# Altium schematic sheet 4.motor.SchDoc: 电机控制
size A4; DrawnBy: 蒋朝晖; Organization: Seneasy; DocumentNumber: 项目编号; Revision: 版本号; SheetNumber: 1; SheetTotal: 2; Time: 2018-10-20
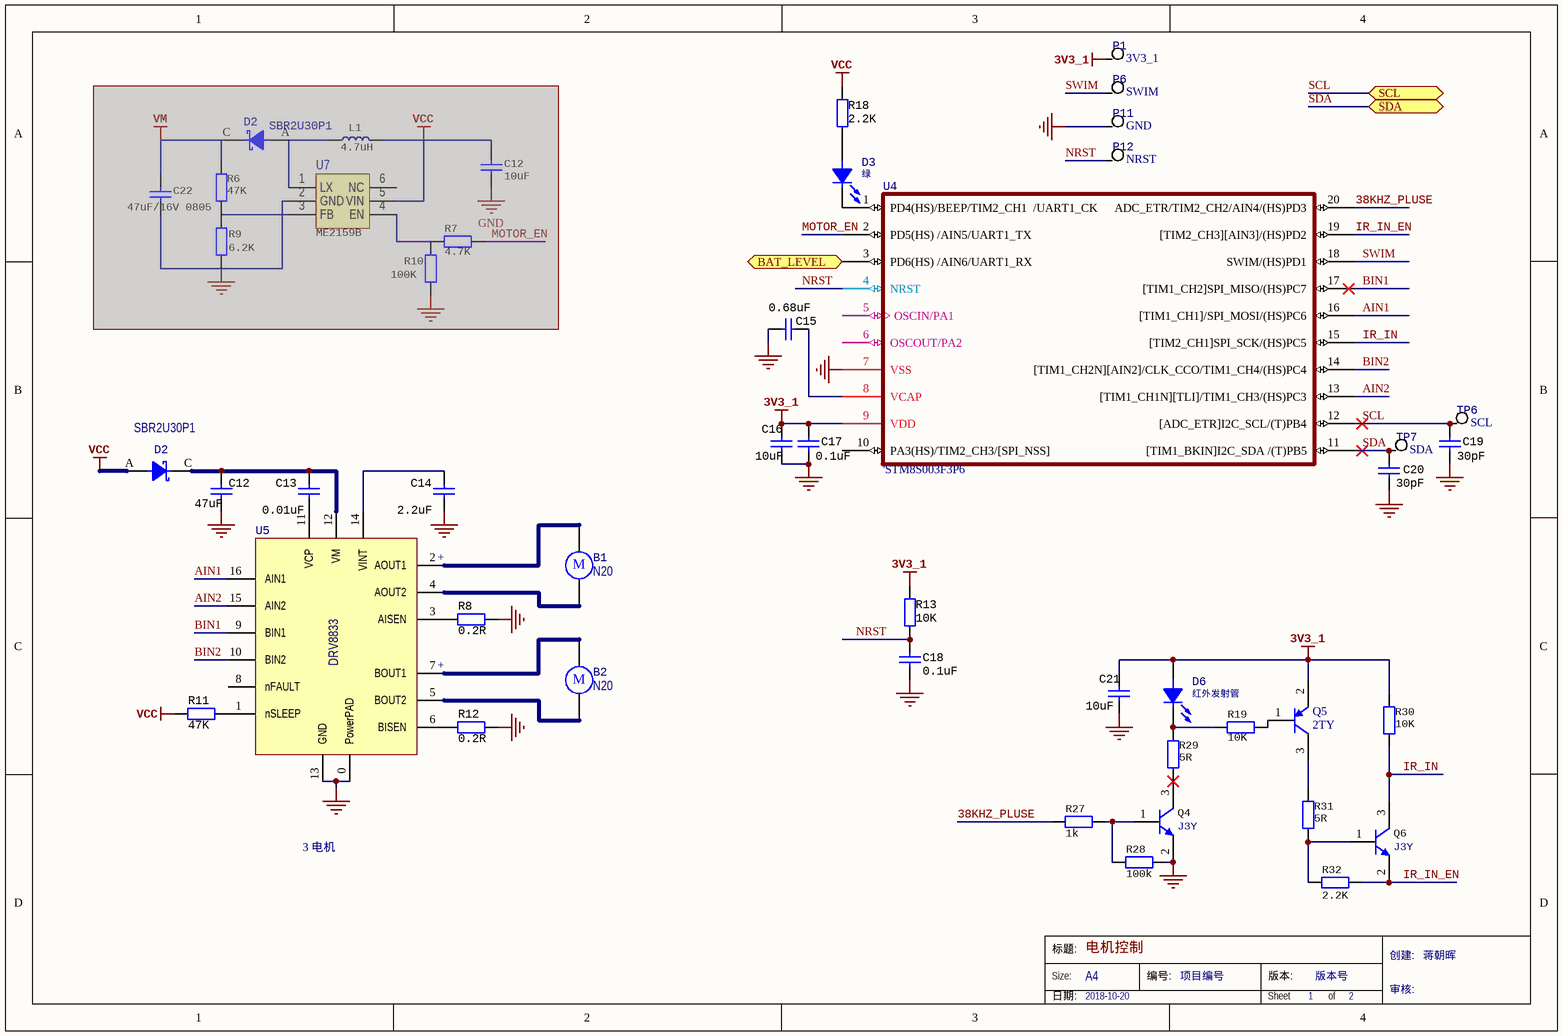
[diagram p0: 4.motor.SchDoc]

## Parts
(Parts that share a designator on the sheet are numbered #1, #2 ... from top to bottom, then left to right.)
B1  N20  [2PIN/2.54MM座子]
B2  N20  [2PIN/2.54MM座子]
C12#1  10uF  [C0603]  (masked out: inside a compile mask, not in the netlist)
C12#2  47uF  [0805]
C13  0.01uF  [0402]
C14  2.2uF  [0402]
C15  0.68uF  [0402]
C16  10uF  [0603]
C17  0.1uF  [0402]
C18  0.1uF  [0402]
C19  30pF  [0402]
C20  30pF  [0402]
C21  10uF  [C0603]
C22  47uF/16V 0805  [C0805]  (masked out: inside a compile mask, not in the netlist)
D2#1  SBR2U30P1  [POWERDI123]  (masked out: inside a compile mask, not in the netlist)
D2#2  SBR2U30P1  [POWERDI123]
D3  绿  [0603LED]
D6  红外发射管  [贴片发射管]
L1  4.7uH  [INDM8070X500N]  (masked out: inside a compile mask, not in the netlist)
P1  3V3_1  [测试点]
P6  SWIM  [测试点]
P11  GND  [测试点]
P12  NRST  [测试点]
Q4  J3Y  [DFN 3L]
Q5  2TY  [DFN 3L]
Q6  J3Y  [DFN 3L]
R6  47K  [R0603]  (masked out: inside a compile mask, not in the netlist)
R7  4.7K  [R0603]  (masked out: inside a compile mask, not in the netlist)
R8  0.2R  [R0603]
R9  6.2K  [R0603]  (masked out: inside a compile mask, not in the netlist)
R10  100K  [R0603]  (masked out: inside a compile mask, not in the netlist)
R11  47K  [0402]
R12  0.2R  [R0603]
R13  10K  [0402]
R18  2.2K  [0402]
R19  10K  [R0402]
R27  1k  [R0402]
R28  100k  [R0402]
R29  5R  [R0603]
R30  10K  [R0402]
R31  5R  [R0603]
R32  2.2K  [R0402]
TP6  SCL  [测试点]
TP7  SDA  [测试点]
U4  'STM8S003F3P6  [UFQFPN20]
U5  DRV8833  [HTSSOP -16(PWP)]
U7  ME2159B  [SOT23-6]  (masked out: inside a compile mask, not in the netlist)

## Ports
BAT_LEVEL (bidir), SCL (bidir), SDA (bidir)

## Nets
3V3_1: C16.1 C17.2 C21.1 D6.A(ANODE) P1.1 Q5.2(E) R13.1 R30.1 U4.9(VDD)
GND: C12#2.2
NetC14_1: C14.1 C15.2 C16.2 C17.1 C18.1 C19.1 C20.1 C21.2 P11.1 Q4.2(E) R8.2 R12.2 R28.2 U4.7(VSS) U5.0(PowerPAD) U5.13(GND)
VCC: D2#2.A(ANODE) R11.1 R18.1
38KHZ_PLUSE: R27.1 U4.20(ADC_ETR/TIM2_CH2/AIN4/(HS)PD3)
AIN1: U4.16([TIM1_CH1]/SPI_MOSI/(HS)PC6) U5.16(AIN1)
AIN2: U4.13([TIM1_CH1N][TLI]/TIM1_CH3/(HS)PC3) U5.15(AIN2)
BAT_LEVEL: U4.3(PD6(HS)_/AIN6/UART1_RX) ; port BAT_LEVEL
BIN1: U4.17([TIM1_CH2]SPI_MISO/(HS)PC7) U5.9(BIN1)
BIN2: U4.14([TIM1_CH2N][AIN2]/CLK_CCO/TIM1_CH4/(HS)PC4) U5.10(BIN2)
IR_IN: Q6.3(C) R30.2 U4.15([TIM2_CH1]SPI_SCK/(HS)PC5)
IR_IN_EN: Q6.2(E) R32.2 U4.19([TIM2_CH3][AIN3]/(HS)PD2)
MOTOR_EN: U4.2(PD5(HS)_/AIN5/UART1_TX)
NRST: C18.2 P12.1 R13.2 U4.4(NRST)
SCL: C19.2 TP6.1 U4.12([ADC_ETR]I2C_SCL/(T)PB4) ; port SCL
SDA: C20.2 TP7.1 U4.11([TIM1_BKIN]I2C_SDA_/(T)PB5) ; port SDA
SWIM: P6.1 U4.18(SWIM/(HS)PD1)
NetB1_1: B1.1 U5.2(AOUT1)
NetB1_2: B1.2 U5.4(AOUT2)
NetB2_1: B2.1 U5.7(BOUT1)
NetB2_2: B2.2 U5.5(BOUT2)
NetC12#2_1: C12#2.1 C13.2 D2#2.C(CATHODE) U5.12(VM)
NetC13_1: C13.1 U5.11(VCP)
NetC14_2: C14.2 U5.14(VINT)
NetC15_1: C15.1 U4.8(VCAP)
NetD3_A: D3.A(ANODE) R18.2
NetD3_C: D3.C(CATHODE) U4.1(PD4(HS)/BEEP/TIM2_CH1__/UART1_CK)
NetD6_C: D6.C(CATHODE) R19.2 R29.2
NetQ4_1: Q4.1(B) R27.2 R28.1
NetQ4_3: Q4.3(C) R29.1
NetQ5_1: Q5.1(B) R19.1
NetQ5_3: Q5.3(C) R31.1
NetQ6_1: Q6.1(B) R31.2 R32.1
NetR8_1: R8.1 U5.3(AISEN)
NetR11_2: R11.2 U5.1(nSLEEP)
NetR12_1: R12.1 U5.6(BISEN)

Not connected (* = marked no-connect by the designer): U4 5(OSCIN/PA1) 6(OSCOUT/PA2) 10(PA3(HS)/TIM2_CH3/[SPI_NSS]); U5 8(nFAULT)

## Notes on the sheet
- (near U5) +
- 3 电机
- 标题:
- Size:
- A4
- 编号:
- 版本:
- 创建:
- 日期:
- Sheet
- of
- 审核:
- (in symbol Motor) M

## Library data of the parts
B1 B2 = Motor: Motor, General Kind; Published: 24-Mar-1999; LatestRevisionDate: 17-Jul-2002; LatestRevisionNote: Re-released for DXP Platform.; PackageReference: RB5-10.5; Publisher: Altium Limited; PackageDescription: Capacitor (Radial); 2 Leads
C12#1 = CAP1_npol: CAP, CERM, 0.01uF, 100V, +/-5%, X7R, 0603; PartNumber: 06031C103JAT2A; Manufacturer: AVX; Polarized: N; Tolerance: 5; ESR_Ohm: 0.098; Voltage Rating DC: 16V; Value: 10uF; RoHS Compliant: Y; MountType: SMT; Dielectric: X7R; ComponentLink1URL: http://www.avx.com/docs/masterpubs/smccp.pdf; PackageReference: 0603; Operating Temperature: -55+125C
C12#2 C13-C21 = CAP1_npol: CAP, CERM, 0.01uF, 100V, +/-5%, X7R, 0603; PartNumber: 06031C103JAT2A; Manufacturer: AVX; Polarized: N; Tolerance: 5; ESR_Ohm: 0.098; Voltage Rating DC: 25V; RoHS Compliant: Y; MountType: SMT; Dielectric: X7R; ComponentLink1URL: http://www.avx.com/docs/masterpubs/smccp.pdf; Operating Temperature: -55+125C; PackageReference: 0603
  C12#2: Value: 47uF
  C13: Value: 0.01uF
  C14: Value: 2.2uF
  C15: Value: 0.68uF
  C16 C21: Value: 10uF
  C17 C18: Value: 0.1uF
  C19 C20: Value: 30pF
C22 = CAP1_npol: CAP, CERM, 0.01uF, 100V, +/-5%, X7R, 0603; PartNumber: 06031C103JAT2A; Manufacturer: AVX; Polarized: N; Value: 10uF; Tolerance: 5; ESR_Ohm: 0.098; Voltage Rating DC: 25V; RoHS Compliant: Y; MountType: SMT; Dielectric: X7R; ComponentLink1URL: http://www.avx.com/docs/masterpubs/smccp.pdf; Operating Temperature: -55+125C; PackageReference: 0603
D2#1 D2#2 = Diode_Schottky: Published: 8-Jun-2000; LatestRevisionDate: 17-Jul-2002; LatestRevisionNote: Re-released for DXP Platform.; PackageReference: SMB; Publisher: Altium Limited; PackageDescription: DO-214-AA/SMB; 2 C-Bend Leads; Body 5.3 x 3.6 mm, inc. leads (LxW); Code_JEDEC: DO-214-AA; Value: ?; PartNumber: ?; Manufacturer: ?
D3 D6 = LED1: Manufacturer: ?; PackageReference: ?; PartNumber: ?; Value: ?
L1 = INDUCTOR
P1 P6 P11 P12 TP6 TP7 = TP: Test Point
Q4 Q6 = 2N3904: NPN General Purpose Amplifier; Published: 8-Jun-2000; LatestRevisionDate: 15-Jan-2003; LatestRevisionNote: PCB Footprint 'BCY-W3/D4.7' replaced; DatasheetVersion: 1997; PackageVersion: Sep-1998; PackageReference: TO-92A; Publisher: Altium Limited; PackageDescription: TO, Flat Index; 3 In-Line, Axial Leads; Body Dia. 4.5mm; Leads 0.51 x 0.48 mm (max); ComponentLink1Description: Manufacturer Link; ComponentLink1URL: http://www.fairchildsemi.com/; ComponentLink2Description: Datasheet; ComponentLink2URL: http://www.fairchildsemi.com/ds/2N%2F2N3904.pdf
Q5 = S8550: PNP Transistor
R6 = RES1: RES, 1.0k ohm, 5%, 0.1W, 0603; PartNumber: RC0603JR-071KL; Manufacturer: Yageo America; CompType: Resistor; Res_ohm: 1000; Value_Code: 1k00; Tolerance_%: 5; Power_W: 0.1; VDC_V: 50; TempCo: 100 ppm/C; EIA_Code: E24; U/M: EA; Value: 100K; SymbolVersion: 2009-05-29; RoHS: Y; Value1: 5%; Value2: 0.1W; MountType: SMT; Technology: Thick Film; Published: 2008-06-26; Publisher: Texas Instruments; LatestRevisionDate: 2014-04-18; ComponentLink1Description: Datasheet link; ComponentLink1URL: http://www.yageo.com/pdf/Pu-RC0603_51_PbFree_L_2.pdf; Supplier Part Number 1: 311-1.0KGRCT-ND; Supplier 2: Mouser; Supplier Part Number 2: 603-RC0603JR-071KL; Supplier 3: Farnell; Supplier Part Number 3: 9233385; PackageReference: 0603
R7 R9 R10 = RES1: RES, 1.0k ohm, 5%, 0.1W, 0603; PartNumber: RC0603JR-071KL; Manufacturer: Yageo America; CompType: Resistor; Res_ohm: 1000; Value_Code: 1k00; Tolerance_%: 5; Power_W: 0.1; VDC_V: 50; TempCo: 100 ppm/C; EIA_Code: E24; U/M: EA; Value: 13.3K; SymbolVersion: 2009-05-29; RoHS: Y; Value1: 5%; Value2: 0.1W; MountType: SMT; Technology: Thick Film; Published: 2008-06-26; Publisher: Texas Instruments; LatestRevisionDate: 2014-04-18; ComponentLink1Description: Datasheet link; ComponentLink1URL: http://www.yageo.com/pdf/Pu-RC0603_51_PbFree_L_2.pdf; Supplier Part Number 1: 311-1.0KGRCT-ND; Supplier 2: Mouser; Supplier Part Number 2: 603-RC0603JR-071KL; Supplier 3: Farnell; Supplier Part Number 3: 9233385; PackageReference: 0603
R8 R11-R13 R18 R19 R27-R32 = RES1: RES, 1.0k ohm, 5%, 0.1W, 0603; PartNumber: RC0603JR-071KL; Manufacturer: Yageo America; CompType: Resistor; Res_ohm: 1000; Value_Code: 1k00; Tolerance_%: 5; Power_W: 0.1; VDC_V: 50; TempCo: 100 ppm/C; EIA_Code: E24; U/M: EA; SymbolVersion: 2009-05-29; RoHS: Y; Value1: 5%; Value2: 0.1W; MountType: SMT; Technology: Thick Film; Published: 2008-06-26; Publisher: Texas Instruments; LatestRevisionDate: 2014-04-18; ComponentLink1Description: Datasheet link; ComponentLink1URL: http://www.yageo.com/pdf/Pu-RC0603_51_PbFree_L_2.pdf; Supplier Part Number 1: 311-1.0KGRCT-ND; Supplier 2: Mouser; Supplier Part Number 2: 603-RC0603JR-071KL; Supplier 3: Farnell; Supplier Part Number 3: 9233385; PackageReference: 0603
  R8 R12: Value: 0.2R
  R11: Value: 47K
  R13 R19 R30: Value: 10K
  R18 R32: Value: 2.2K
  R27: Value: 1k
  R28: Value: 100k
  R29 R31: Value: 5R
U4 = STM8S103F2P6: ST 8-bit  Microcontroller
U5 = DRV8833PWP: DUAL H-BRIDGE MOTOR DRIVER
U7 = ME2159: DC DC升压IC